# EasyEDA schematic SCH_Esp32-Wroom-Air-suspension_2025-01-09.json
TITLE: AirSuspension Esp32; REV: 1.0; Date: 2024-06-21; Sheet: 1/1; Drawn By: pnieminen
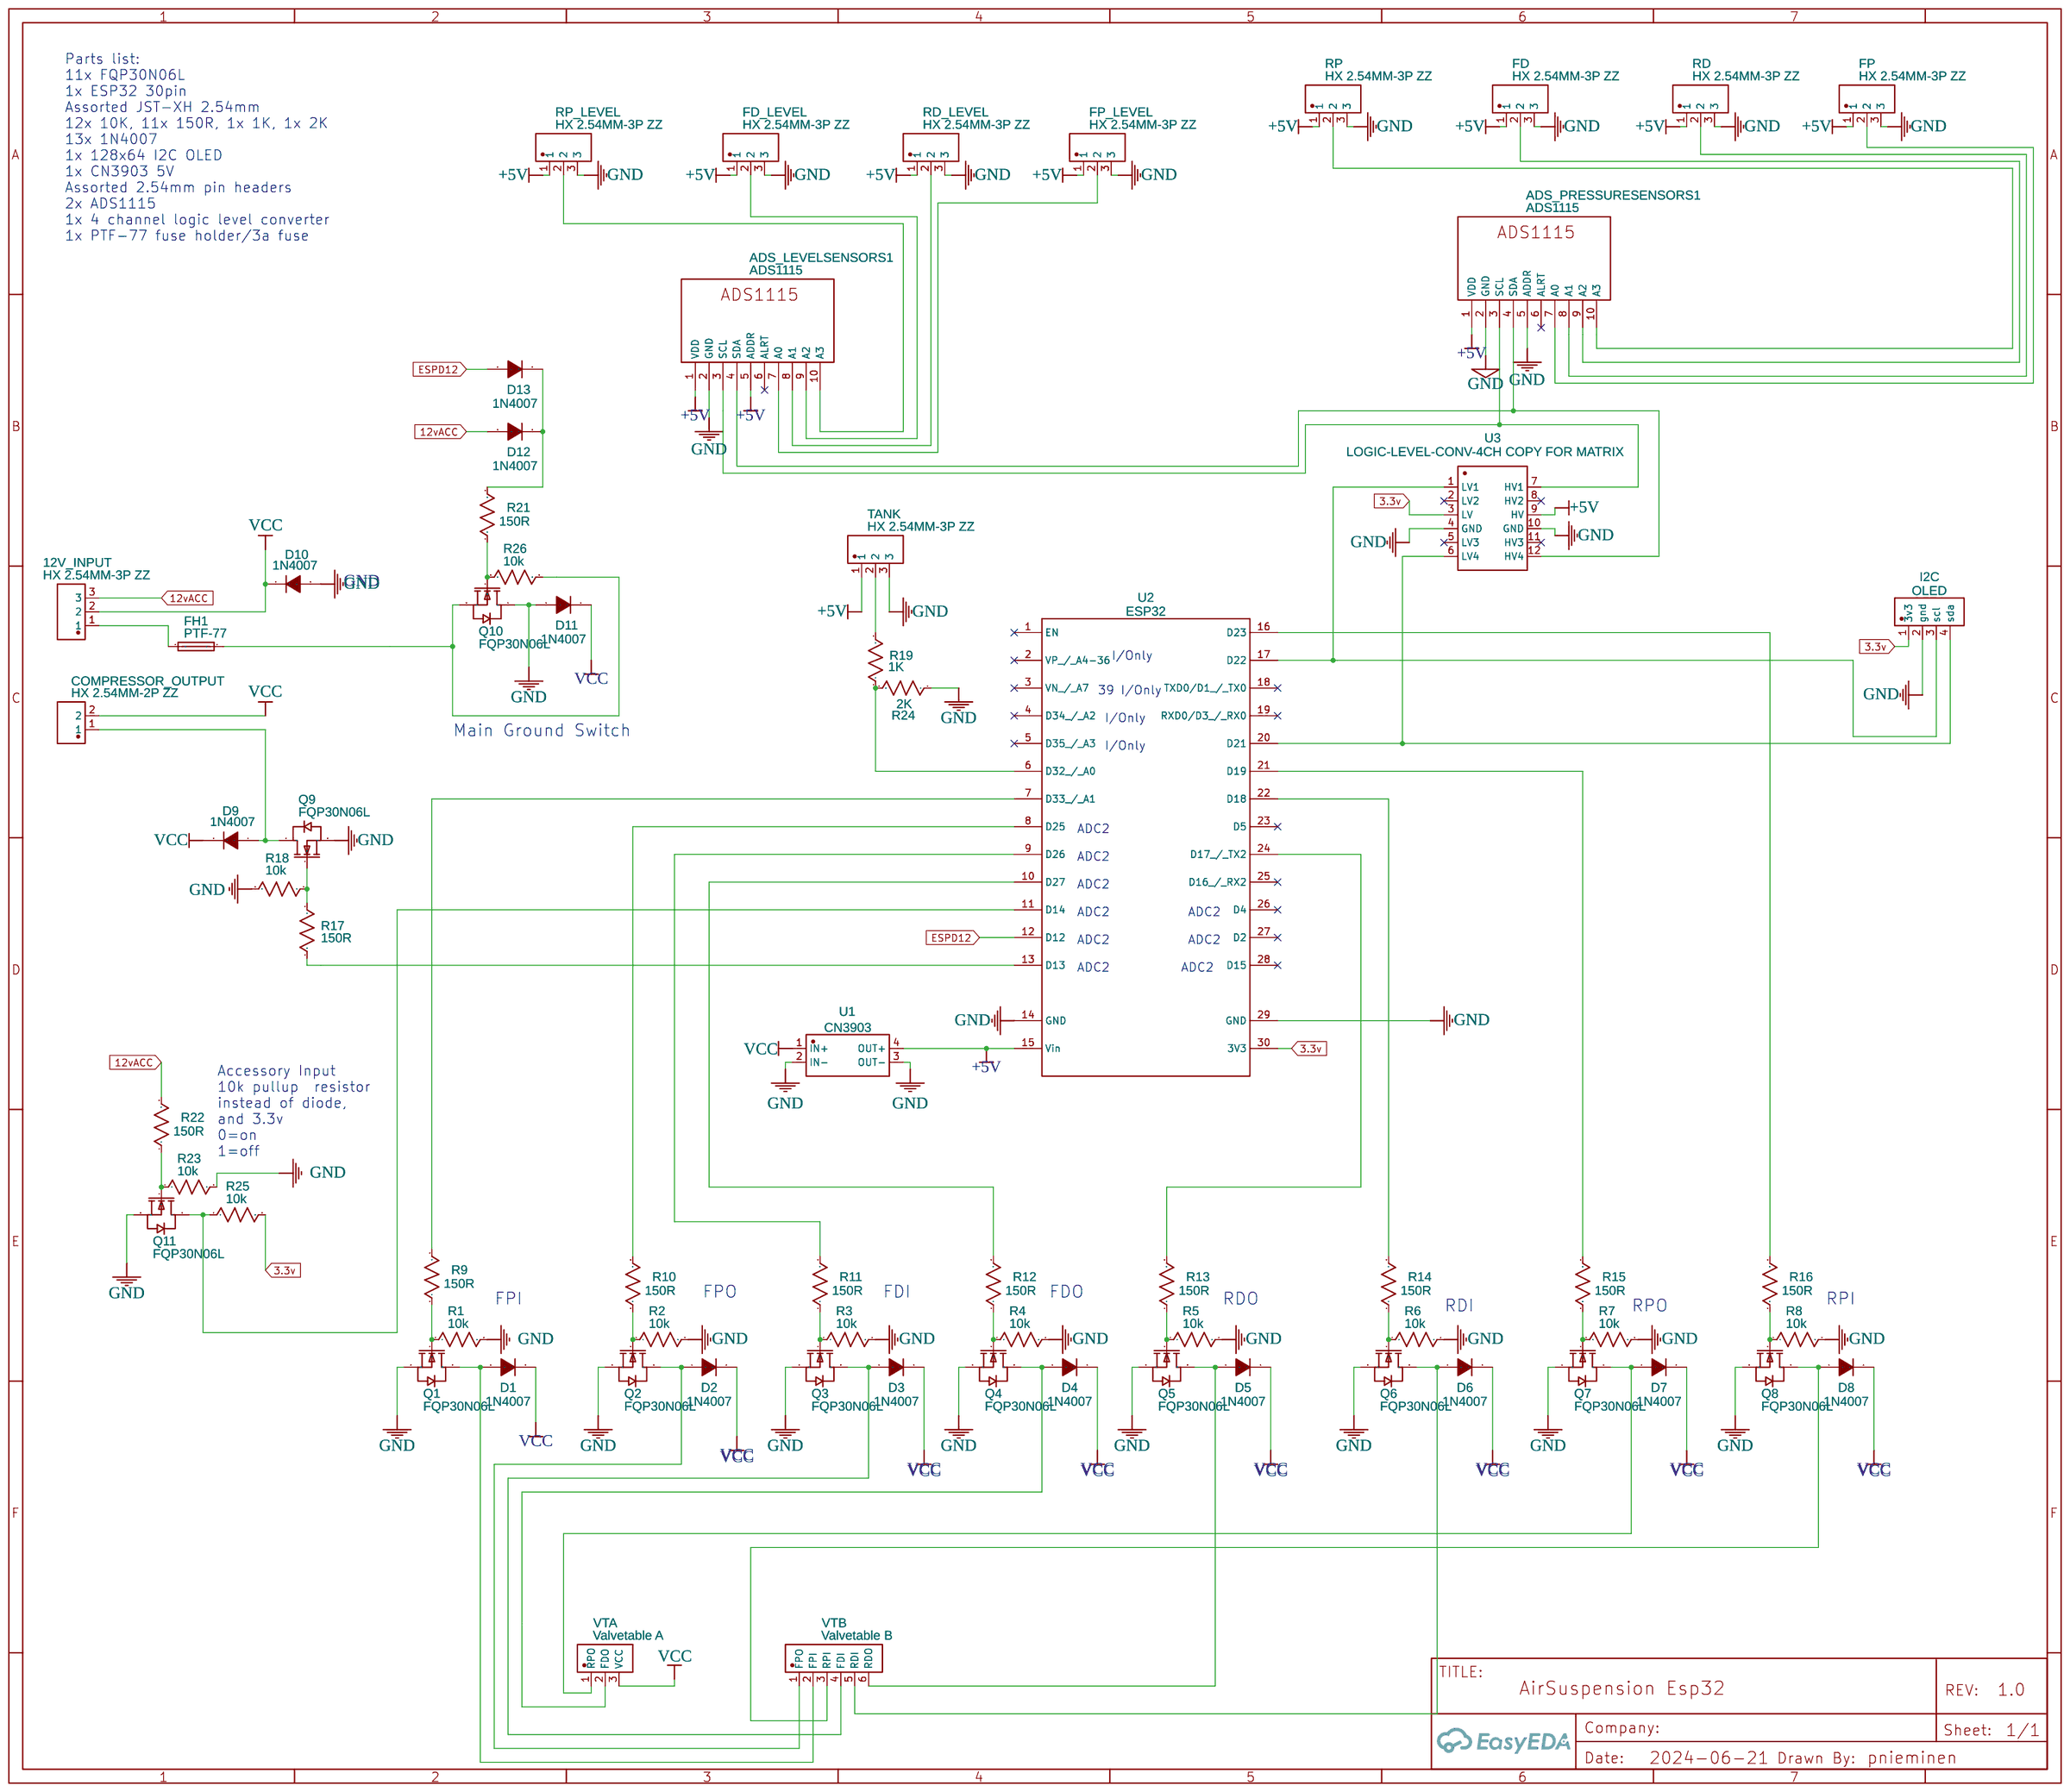
[diagram p0: schematic sheet]

## Parts
12V_INPUT  HX 2.54MM-3P ZZ  [CONN-TH_3P-P2.50_HX-2.54MM-3P-ZZ-MS]
ADS_LEVELSENSORS1  ADS1115  [ADS1115-16BIT ANALOG DIGITAL CONVERTER]
ADS_PRESSURESENSORS1  ADS1115  [ADS1115-16BIT ANALOG DIGITAL CONVERTER]
COMPRESSOR_OUTPUT  HX 2.54MM-2P ZZ  [CONN-TH_2P-P2.50_HX-2.54MM-2P-ZZ-MS]
D1  1N4007  [DO-41_BD2.4-L4.7-P8.70-D0.9-FD]
D2  1N4007  [DO-41_BD2.4-L4.7-P8.70-D0.9-FD]
D3  1N4007  [DO-41_BD2.4-L4.7-P8.70-D0.9-FD]
D4  1N4007  [DO-41_BD2.4-L4.7-P8.70-D0.9-FD]
D5  1N4007  [DO-41_BD2.4-L4.7-P8.70-D0.9-FD]
D6  1N4007  [DO-41_BD2.4-L4.7-P8.70-D0.9-FD]
D7  1N4007  [DO-41_BD2.4-L4.7-P8.70-D0.9-FD]
D8  1N4007  [DO-41_BD2.4-L4.7-P8.70-D0.9-FD]
D9  1N4007  [DO-41_BD2.4-L4.7-P8.70-D0.9-FD]
D10  1N4007  [DO-41_BD2.4-L4.7-P8.70-D0.9-FD]
D11  1N4007  [DO-41_BD2.4-L4.7-P8.70-D0.9-FD]
D12  1N4007  [DO-41_BD2.4-L4.7-P8.70-D0.9-FD]
D13  1N4007  [DO-41_BD2.4-L4.7-P8.70-D0.9-FD]
FD  HX 2.54MM-3P ZZ  [CONN-TH_3P-P2.50_HX-2.54MM-3P-ZZ-MS]
FD_LEVEL  HX 2.54MM-3P ZZ  [CONN-TH_3P-P2.50_HX-2.54MM-3P-ZZ-MS]
FH1  PTF-77  [FUSE-TH_L24.4-W9.4-P22.60]
FP  HX 2.54MM-3P ZZ  [CONN-TH_3P-P2.50_HX-2.54MM-3P-ZZ-MS]
FP_LEVEL  HX 2.54MM-3P ZZ  [CONN-TH_3P-P2.50_HX-2.54MM-3P-ZZ-MS]
OLED  I2C  [CONN-TH_4P-P2.50_HX-2.54MM-4P-ZZ-MS]
Q1  FQP30N06L  [TO-220AB-3_L10.3-W5.0-P2.54-L]
Q2  FQP30N06L  [TO-220AB-3_L10.3-W5.0-P2.54-L]
Q3  FQP30N06L  [TO-220AB-3_L10.3-W5.0-P2.54-L]
Q4  FQP30N06L  [TO-220AB-3_L10.3-W5.0-P2.54-L]
Q5  FQP30N06L  [TO-220AB-3_L10.3-W5.0-P2.54-L]
Q6  FQP30N06L  [TO-220AB-3_L10.3-W5.0-P2.54-L]
Q7  FQP30N06L  [TO-220AB-3_L10.3-W5.0-P2.54-L]
Q8  FQP30N06L  [TO-220AB-3_L10.3-W5.0-P2.54-L]
Q9  FQP30N06L  [TO-220AB-3_L10.3-W5.0-P2.54-L]
Q10  FQP30N06L  [TO-220AB-3_L10.3-W5.0-P2.54-L]
Q11  FQP30N06L  [TO-220AB-3_L10.3-W5.0-P2.54-L]
R1  10k  [RESISTOR_1WATT_TH]
R2  10k  [RESISTOR_1WATT_TH]
R3  10k  [RESISTOR_1WATT_TH]
R4  10k  [RESISTOR_1WATT_TH]
R5  10k  [RESISTOR_1WATT_TH]
R6  10k  [RESISTOR_1WATT_TH]
R7  10k  [RESISTOR_1WATT_TH]
R8  10k  [RESISTOR_1WATT_TH]
R9  150R  [RESISTOR_1WATT_TH]
R10  150R  [RESISTOR_1WATT_TH]
R11  150R  [RESISTOR_1WATT_TH]
R12  150R  [RESISTOR_1WATT_TH]
R13  150R  [RESISTOR_1WATT_TH]
R14  150R  [RESISTOR_1WATT_TH]
R15  150R  [RESISTOR_1WATT_TH]
R16  150R  [RESISTOR_1WATT_TH]
R17  150R  [RESISTOR_1WATT_TH]
R18  10k  [RESISTOR_1WATT_TH]
R19  1K  [RESISTOR_1WATT_TH]
R21  150R  [RESISTOR_1WATT_TH]
R22  150R  [RESISTOR_1WATT_TH]
R23  10k  [RESISTOR_1WATT_TH]
R24  2K  [RESISTOR_1WATT_TH]
R25  10k  [RESISTOR_1WATT_TH]
R26  10k  [RESISTOR_1WATT_TH]
RD  HX 2.54MM-3P ZZ  [CONN-TH_3P-P2.50_HX-2.54MM-3P-ZZ-MS]
RD_LEVEL  HX 2.54MM-3P ZZ  [CONN-TH_3P-P2.50_HX-2.54MM-3P-ZZ-MS]
RP  HX 2.54MM-3P ZZ  [CONN-TH_3P-P2.50_HX-2.54MM-3P-ZZ-MS]
RP_LEVEL  HX 2.54MM-3P ZZ  [CONN-TH_3P-P2.50_HX-2.54MM-3P-ZZ-MS]
TANK  HX 2.54MM-3P ZZ  [CONN-TH_3P-P2.50_HX-2.54MM-3P-ZZ-MS]
U1  CN3903  [CN3903 DCDC]
U2  ESP32  [ESP32WROOM32]
U3  LOGIC-LEVEL-CONV-4CH COPY FOR MATRIX  [LOGICLEVELCONVERTER]
VTA  Valvetable A  [CONN-TH_3P-P2.50_HX-2.54MM-3P-ZZ-MS]
VTB  Valvetable B  [CONN-TH_6P-P2.50_HX-2.54MM-6P-ZZ-MS]

## Library data of the parts
12V_INPUT FD FD_LEVEL FP FP_LEVEL RD RD_LEVEL RP RP_LEVEL TANK VTA = HX 2.54MM-3P ZZ: Supplier: LCSC; Supplier Part: C7543432; Manufacturer: hanxia(韩下); Manufacturer Part: HX 2.54mm-3P ZZ; Contributor: lcsc; JLCPCB Part Class: Extended Part
ADS_LEVELSENSORS1 ADS_PRESSURESENSORS1 = ADS1115: link: https://www.aliexpress.com/item/32817162654.html?spm=a2g0s.9042311.0.0.27424c4daxBd1l; Contributor: gopro2027
COMPRESSOR_OUTPUT = HX 2.54MM-2P ZZ: Supplier: LCSC; Supplier Part: C7543431; Manufacturer: hanxia(韩下); Manufacturer Part: HX 2.54mm-2P ZZ; Contributor: lcsc; JLCPCB Part Class: Extended Part
D1-D13 = 1N4007-E3/54: Supplier: LCSC; Manufacturer: VISHAY; Supplier Part: C84643; JLCPCB Part Class: Extended Part
FH1 = PTF-77: Contributor: LCSC; Supplier: LCSC; Supplier Part: C717030; Manufacturer: XFCN(兴飞); JLCPCB Part Class: Extended Part
OLED = HX 2.54MM-4P ZZ: Supplier: LCSC; Supplier Part: C7543433; Manufacturer: hanxia(韩下); Manufacturer Part: HX 2.54mm-4P ZZ; Contributor: lcsc; JLCPCB Part Class: Extended Part
Q1-Q11 = FQP30N06L: Contributor: LCSC; Supplier: LCSC; Supplier Part: C878826; Manufacturer: VBsemi(微碧半导体); Manufacturer Part: FQP30N06L-VB; JLCPCB Part Class: Extended Part
R1-R19 R21-R26 = R_AXIAL-1.0_US: Contributor: jongi84
U1 = CN3903-DCDC-STEPDOWN-3V3: Supplier: Aliexpress; link: https://www.aliexpress.com/item/1005002830334910.html?spm=a2g0s.9042311.0.0.251d4c4ddfGCCY; Contributor: Joachim Muller
U2 = ESP32: Manufacturer: Espressif Systems; Supplier Part: ESP-WROOM-32; link: chrome-extension://efaidnbmnnnibpcajpcglclefindmkaj/https://agelectronica.lat/pdfs/textos/E/ESP-WROOM-32.PDF; Contributor: venkateshdeven14; Package Display: No
U3 = LOGIC-LEVEL-CONV-4CH COPY FOR MATRIX: Supplier: LCSC; Supplier Part: C2829587; Manufacturer: null; Manufacturer Part: Level Converter 4; Contributor: AtifIqbal; JLCPCB Part Class: Extended Part
VTB = HX 2.54MM-6P ZZ: Supplier: LCSC; Supplier Part: C7543435; Manufacturer: hanxia(韩下); Manufacturer Part: HX 2.54mm-6P ZZ; Contributor: lcsc; JLCPCB Part Class: Extended Part

## Nets
3.3v: OLED.1(3v3) R25.2 U2.30(3V3) U3.3(LV)
12vACC: 12V_INPUT.3 D12.1(A) R22.2
+5V: ADS_LEVELSENSORS1.1(VDD) ADS_LEVELSENSORS1.5(ADDR) ADS_PRESSURESENSORS1.1(VDD) FD.1 FD_LEVEL.1 FP.1 FP_LEVEL.1 RD.1 RD_LEVEL.1 RP.1 RP_LEVEL.1 TANK.1 U1.4(OUT+) U2.15(Vin) U3.9(HV)
GND: ADS_LEVELSENSORS1.2(GND) ADS_PRESSURESENSORS1.2(GND) ADS_PRESSURESENSORS1.5(ADDR) D10.1(A) D11.1(A) FD.3 FD_LEVEL.3 FP.3 FP_LEVEL.3 OLED.2(gnd) Q1.3(S) Q2.3(S) Q3.3(S) Q4.3(S) Q5.3(S) Q6.3(S) Q7.3(S) Q8.3(S) Q9.3(S) Q10.2(D) Q11.3(S) R1.2 R2.2 R3.2 R4.2 R5.2 R6.2 R7.2 R8.2 R18.2 R23.2 R24.1 RD.3 RD_LEVEL.3 RP.3 RP_LEVEL.3 TANK.3 U1.2(IN-) U1.3(OUT-) U2.14(GND) U2.29(GND) U3.4(GND) U3.10(GND)
VCC: 12V_INPUT.2 COMPRESSOR_OUTPUT.2 D1.2(K) D2.2(K) D3.2(K) D4.2(K) D5.2(K) D6.2(K) D7.2(K) D8.2(K) D9.2(K) D10.2(K) D11.2(K) U1.1(IN+) VTA.3(VCC)
ESPD12: D13.1(A) U2.12(D12)
Net-(12V_INPUT-1): 12V_INPUT.1 FH1.1
Net-(ADS_LEVELSENSORS1-3): ADS_LEVELSENSORS1.3(SCL) ADS_PRESSURESENSORS1.3(SCL) U3.7(HV1)
Net-(ADS_LEVELSENSORS1-4): ADS_LEVELSENSORS1.4(SDA) ADS_PRESSURESENSORS1.4(SDA) U3.12(HV4)
Net-(ADS_LEVELSENSORS1-7): ADS_LEVELSENSORS1.7(A0) FP_LEVEL.2
Net-(ADS_LEVELSENSORS1-8): ADS_LEVELSENSORS1.8(A1) RD_LEVEL.2
Net-(ADS_LEVELSENSORS1-9): ADS_LEVELSENSORS1.9(A2) FD_LEVEL.2
Net-(ADS_LEVELSENSORS1-10): ADS_LEVELSENSORS1.10(A3) RP_LEVEL.2
Net-(ADS_PRESSURESENSORS1-7): ADS_PRESSURESENSORS1.7(A0) FP.2
Net-(ADS_PRESSURESENSORS1-8): ADS_PRESSURESENSORS1.8(A1) RD.2
Net-(ADS_PRESSURESENSORS1-9): ADS_PRESSURESENSORS1.9(A2) FD.2
Net-(ADS_PRESSURESENSORS1-10): ADS_PRESSURESENSORS1.10(A3) RP.2
Net-(COMPRESSOR_OUTPUT-1): COMPRESSOR_OUTPUT.1 D9.1(A) Q9.2(D)
Net-(D1-1): D1.1(A) Q1.2(D) VTB.2(FPI)
Net-(D2-1): D2.1(A) Q2.2(D) VTB.1(FPO)
Net-(D3-1): D3.1(A) Q3.2(D) VTB.4(FDI)
Net-(D4-1): D4.1(A) Q4.2(D) VTA.2(FDO)
Net-(D5-1): D5.1(A) Q5.2(D) VTB.6(RDO)
Net-(D6-1): D6.1(A) Q6.2(D) VTB.5(RDI)
Net-(D7-1): D7.1(A) Q7.2(D) VTA.1(RPO)
Net-(D8-1): D8.1(A) Q8.2(D) VTB.3(RPI)
Net-(D12-2): D12.2(K) D13.2(K) R21.2
Net-(FH1-2): FH1.2 Q10.3(S) R26.2
Net-(OLED-3): OLED.3(scl) U2.17(D22) U3.1(LV1)
Net-(OLED-4): OLED.4(sda) U2.20(D21) U3.6(LV4)
Net-(Q1-1): Q1.1(G) R1.1 R9.1
Net-(Q2-1): Q2.1(G) R2.1 R10.1
Net-(Q3-1): Q3.1(G) R3.1 R11.1
Net-(Q4-1): Q4.1(G) R4.1 R12.1
Net-(Q5-1): Q5.1(G) R5.1 R13.1
Net-(Q6-1): Q6.1(G) R6.1 R14.1
Net-(Q7-1): Q7.1(G) R7.1 R15.1
Net-(Q8-1): Q8.1(G) R8.1 R16.1
Net-(Q9-1): Q9.1(G) R17.1 R18.1
Net-(Q10-1): Q10.1(G) R21.1 R26.1
Net-(Q11-1): Q11.1(G) R22.1 R23.1
Net-(Q11-2): Q11.2(D) R25.1 U2.11(D14)
Net-(R9-2): R9.2 U2.7(D33 / A1)
Net-(R10-2): R10.2 U2.8(D25)
Net-(R11-2): R11.2 U2.9(D26)
Net-(R12-2): R12.2 U2.10(D27)
Net-(R13-2): R13.2 U2.24(D17 / TX2)
Net-(R14-2): R14.2 U2.22(D18)
Net-(R15-2): R15.2 U2.21(D19)
Net-(R16-2): R16.2 U2.16(D23)
Net-(R17-2): R17.2 U2.13(D13)
Net-(R19-1): R19.1 R24.2 U2.6(D32 / A0)
Net-(R19-2): R19.2 TANK.2

Not connected (* = marked no-connect by the designer): ADS_LEVELSENSORS1 6(ALRT)*; ADS_PRESSURESENSORS1 6(ALRT)*; U2 1(EN)* 2(VP / A4-36)* 3(VN / A7)* 4(D34 / A2)* 5(D35 / A3)* 18(TXD0/D1 / TX0)* 19(RXD0/D3 / RX0)* 23(D5)* 25(D16 / RX2)* 26(D4)* 27(D2)* 28(D15)*; U3 2(LV2)* 5(LV3)* 8(HV2)* 11(HV3)*

## Notes on the sheet
- Parts list:
  11x FQP30N06L
  1x ESP32 30pin
  Assorted JST-XH 2.54mm
  12x 10K, 11x 150R, 1x 1K, 1x 2K
  13x 1N4007
  1x 128x64 I2C OLED
  1x CN3903 5V
  Assorted 2.54mm pin headers
  2x ADS1115
  1x 4 channel logic level converter
  1x PTF-77 fuse holder/3a fuse
- GND
- I/Only
- 39 I/Only
- I/Only
- Main Ground Switch
- I/Only
- ADC2
- ADC2
- ADC2
- ADC2
- ADC2
- ADC2
- ADC2
- ADC2
- ADC2
- Accessory Input
  10k pullup  resistor
  instead of diode,
  and 3.3v
  0=on
  1=off
- FPI
- FPO
- FDI
- FDO
- RDO
- RPI
- RDI
- RPO
- VCC
- VCC
- VCC
- VCC
- VCC
- VCC
- VCC
